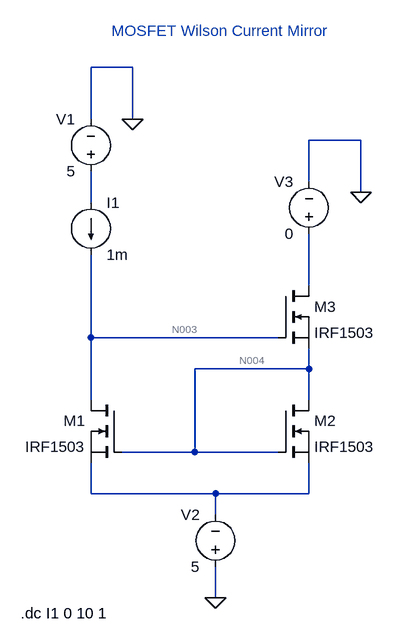
[diagram p0: schematic Draft3.asc]
Draft3.asc, the LTspice schematic file:
Version 4
SHEET 1 880 824
WIRE 80 -32 16 -32
WIRE 16 48 16 -32
WIRE 80 48 80 -32
WIRE 432 80 352 80
WIRE 352 144 352 80
WIRE 432 160 432 80
WIRE 16 176 16 128
WIRE 352 304 352 224
WIRE 16 384 16 256
WIRE 304 384 16 384
WIRE 352 432 352 400
WIRE 352 432 176 432
WIRE 16 480 16 384
WIRE 352 480 352 432
WIRE 176 560 176 432
WIRE 176 560 64 560
WIRE 304 560 176 560
WIRE 16 624 16 576
WIRE 208 624 16 624
WIRE 352 624 352 576
WIRE 352 624 208 624
WIRE 208 656 208 624
WIRE 208 784 208 736
FLAG 80 48 0
FLAG 208 784 0
FLAG 432 160 0
SYMBOL voltage 16 144 R180
WINDOW 0 24 96 Left 2
WINDOW 3 24 16 Left 2
WINDOW 123 0 0 Left 0
WINDOW 39 0 0 Left 0
SYMATTR InstName V1
SYMATTR Value 5
SYMBOL current 16 176 R0
WINDOW 123 0 0 Left 0
WINDOW 39 0 0 Left 0
SYMATTR InstName I1
SYMATTR Value 1m
SYMBOL nmos 64 480 M0
SYMATTR InstName M1
SYMATTR Value IRF1503
SYMBOL nmos 304 480 R0
SYMATTR InstName M2
SYMATTR Value IRF1503
SYMBOL nmos 304 304 R0
SYMATTR InstName M3
SYMATTR Value IRF1503
SYMBOL voltage 208 752 R180
WINDOW 0 24 96 Left 2
WINDOW 3 24 16 Left 2
WINDOW 123 0 0 Left 0
WINDOW 39 0 0 Left 0
SYMATTR InstName V2
SYMATTR Value 5
SYMBOL voltage 352 240 R180
WINDOW 0 24 96 Left 2
WINDOW 3 24 16 Left 2
WINDOW 123 0 0 Left 0
WINDOW 39 0 0 Left 0
SYMATTR InstName V3
SYMATTR Value 0
TEXT 48 -88 Left 2 ;MOSFET Wilson Current Mirror
TEXT -92 808 Left 2 !.dc I1 0 10 1

The netlist it stands for:
* Draft3.asc
V1 N001 0 5
I1 N001 N003 1m
M1 N003 N004 N005 N005 IRF1503
M2 N004 N004 N005 N005 IRF1503
M3 N002 N003 N004 N004 IRF1503
V2 0 N005 5
V3 N002 0 0
.model NMOS NMOS
.model PMOS PMOS
.lib standard.mos
* MOSFET Wilson Current Mirror
.dc I1 0 10 1
.backanno
.end

* Results of the author's LTspice run, read from the files saved beside the schematic
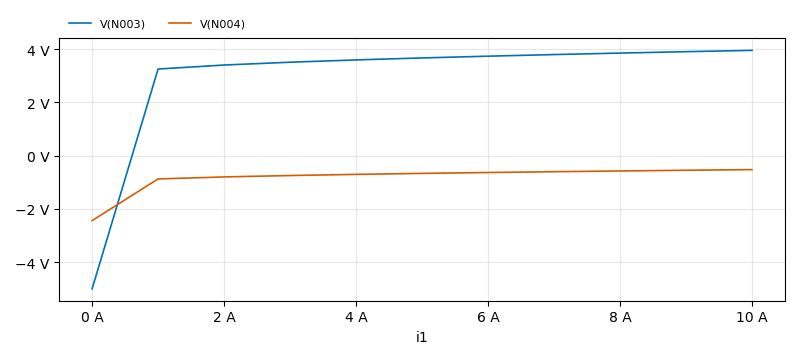
[diagram p1: DC transfer characteristic of Draft3.asc, plotted from the saved traces]
* DC transfer characteristic, 1 run:
*   V(N003): -4.998 V at i1=0 A, 3.952 V at i1=10 A, min -4.998 V, max 3.952 V
*   V(N004): -2.439 V at i1=0 A, -524.1 mV at i1=10 A, min -2.439 V, max -524.1 mV